# EAGLE design 1 byte output (EAGLE 9.5.0)
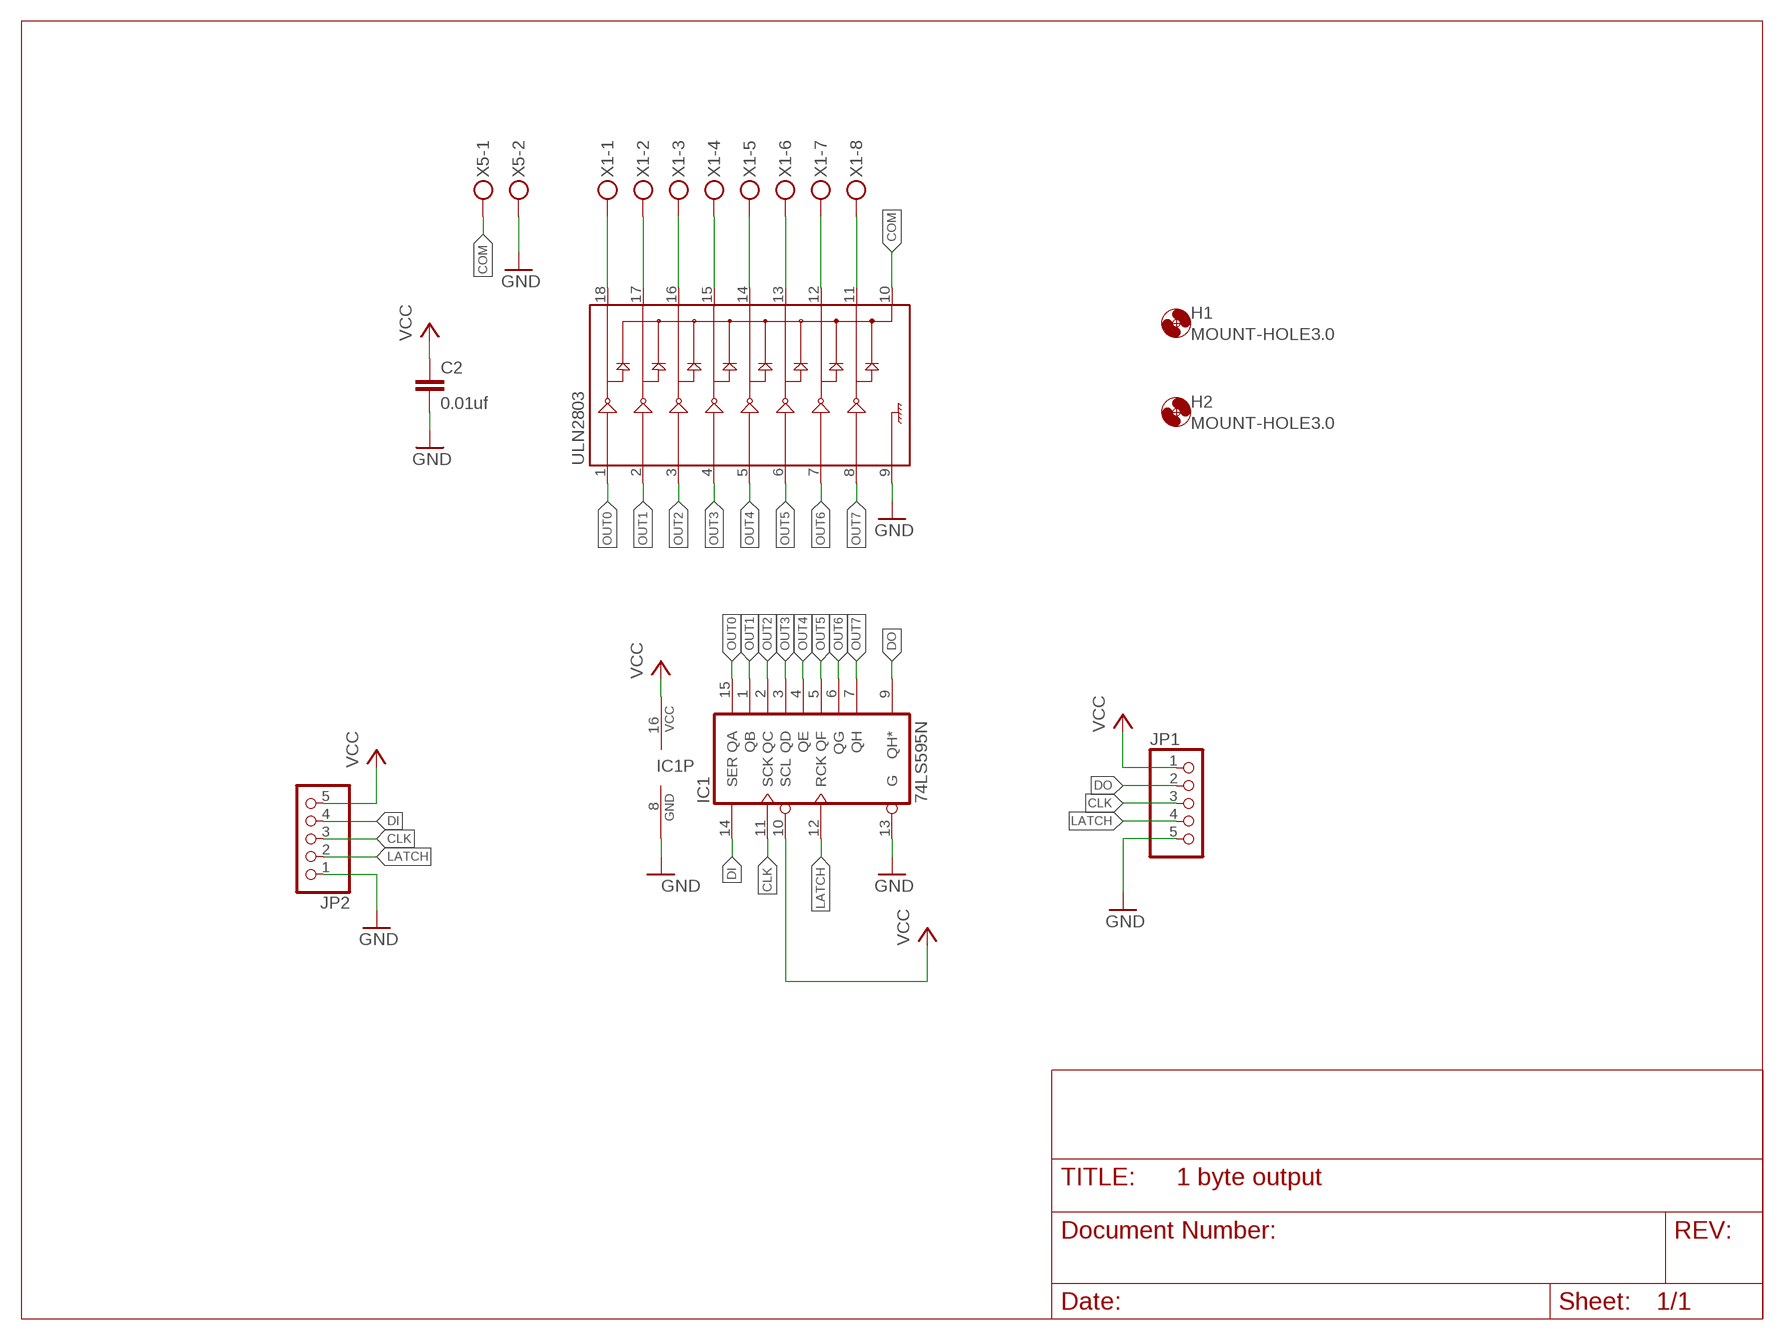
[diagram p0: schematic, sheet 1]

## Parts
C2  0.01uf  C-EU050-035X075  [C050-035X075]
H1  MOUNT-HOLE3.0  [3,0]
H2  MOUNT-HOLE3.0  [3,0]
IC1  74LS595N  [DIL16]
JP1  PINHD-1X5/90  [1X05/90]
JP2  PINHD-1X5/90  [1X05/90]
ULN2803  ULN2803DIP  [DIL18]
X1  MKDSN1,5/8-5,08  [MKDSN1,5/8-5,08]
X5  MKDSN1,5/2-5,08  [MKDSN1,5/2-5,08]

## Nets
CLK: IC1.11(SCK) JP1.3 JP2.3
COM: ULN2803.10 X5.1
DI: IC1.14(SER) JP2.4
DO: IC1.9(QH*) JP1.2
GND: C2.2 IC1.8(GND) IC1.13(G) JP1.5 JP2.1 ULN2803.9 X5.2
LATCH: IC1.12(RCK) JP1.4 JP2.2
N$1: ULN2803.18 X1.1
N$2: ULN2803.17 X1.2
N$3: ULN2803.16 X1.3
N$4: ULN2803.15 X1.4
N$5: ULN2803.14 X1.5
N$6: ULN2803.13 X1.6
N$7: ULN2803.12 X1.7
N$8: ULN2803.11 X1.8
OUT0: IC1.15(QA) ULN2803.1
OUT1: IC1.1(QB) ULN2803.2
OUT2: IC1.2(QC) ULN2803.3
OUT3: IC1.3(QD) ULN2803.4
OUT4: IC1.4(QE) ULN2803.5
OUT5: IC1.5(QF) ULN2803.6
OUT6: IC1.6(QG) ULN2803.7
OUT7: IC1.7(QH) ULN2803.8
VCC: C2.1 IC1.10(SCL) IC1.16(VCC) JP1.1 JP2.5

## Library data of the parts
C2 = resistor:C-EU: CAPACITOR, European symbol
H1 H2 = holes:MOUNT-HOLE: MOUNTING HOLE with drill center marker
IC1 = 74xx-us:74*595: 8-bit SHIFT REGISTER, output latch
JP1 JP2 = pinhead:PINHD-1X5: PIN HEADER
ULN2803 = SparkFun-IC-Special-Function:ULN2803: Darlington Driver(IC-07959, low stock) ULN2803 Darlington array. 500mA max per channel, 8-channel package. Spark Fun Electronics SKU : COM-00312
X1 = con-phoenix-508:MKDSN1,5/8-5,08: MKDSN 1,5/ 8-5,08 Printklemme Nennstrom: 13,5 A Nennspannung: 250 V Rastermaß: 5,08 mm Polzahl: 8 Anschlussart: Schraubanschluss Montage: Löten Anschlussrichtung Leiter/Platine: 0 ° Artikelnummer: 1729186 Source: http://eshop.phoenixcontact.com .. 1729186.pdf
X5 = con-phoenix-508:MKDSN1,5/2-5,08: MKDSN 1,5/ 2-5,08 Printklemme Nennstrom: 13,5 A Nennspannung: 250 V Rastermaß: 5,08 mm Polzahl: 2 Anschlussart: Schraubanschluss Montage: Löten Anschlussrichtung Leiter/Platine: 0 ° Artikelnummer: 1729128 Source: http://eshop.phoenixcontact.com .. 1729128.pdf

## Board
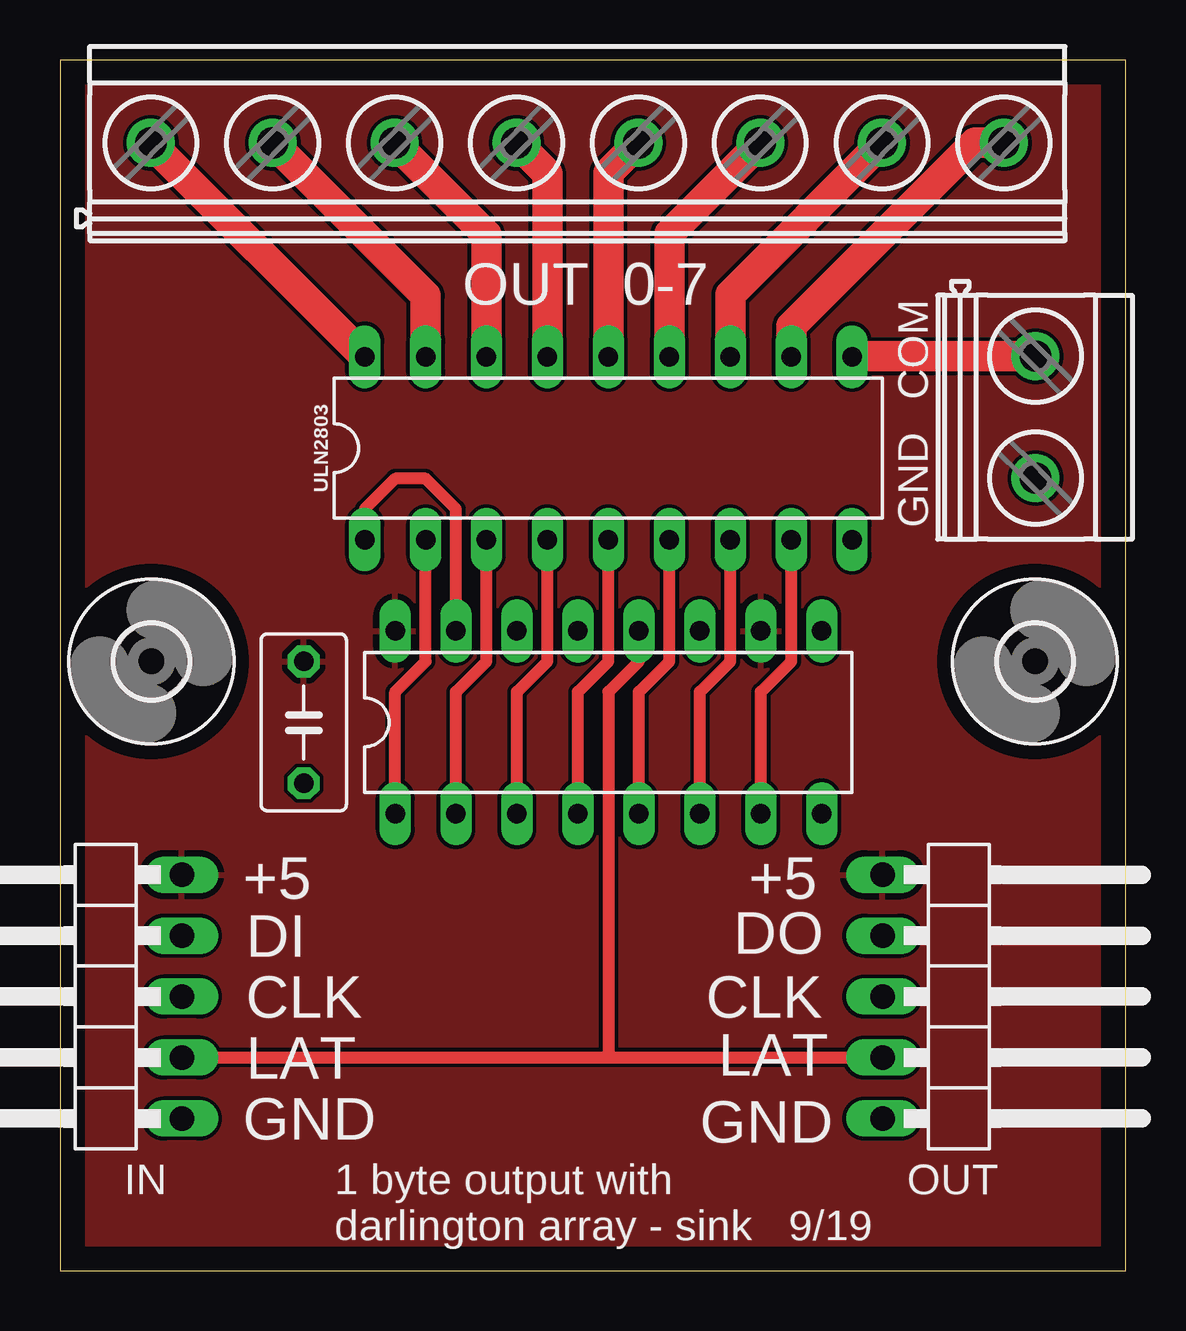
[diagram p1: board, top side]
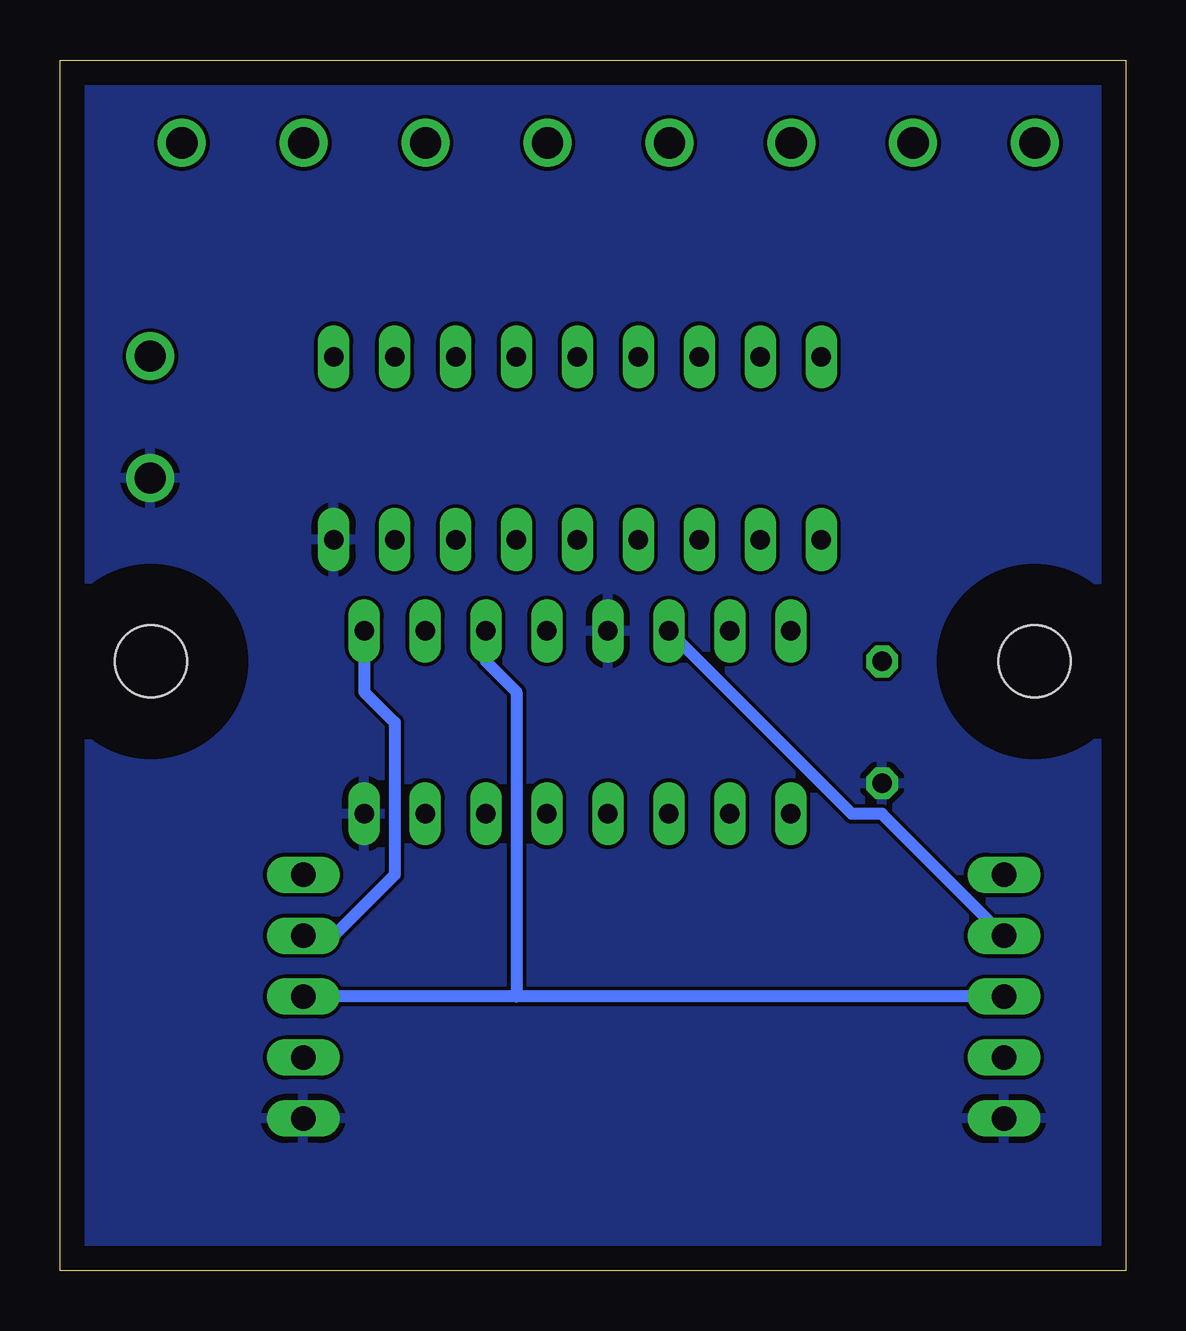
[diagram p2: board, bottom side, seen from below]

Size 44.43 x 50.47 mm. Coordinates in mm from the lower left corner, seen from the top.
Outline: 0,0 44.43,0 44.43,50.47 0,50.47 0,0
Copper layers (1*16): Top 0.035mm / dielectric 1.5mm / Bottom 0.035mm
Design rules "default": minimum track width 6mil, minimum drill 0.35mm, track to track 6mil, track to pad 6mil, pad to pad 6mil, via to via 6mil, smd to smd 6mil, copper to edge 40mil, drill to drill 6mil, minimum pad ring 10mil, minimum via ring 8mil, stop-mask expansion 4mil, vias tented up to drill 0mil, thermal gap 10mil

### Footprints (pad centres in the part's own frame; a part is rotated, then mirrored left to right if it is on the bottom)
C050-035X075 = drill 0.813 octagon: 1 -2.54,0; 2 2.54,0
3,0 = hole 3: 0,0
DIL16 = drill 0.813 long: 1 -8.89,-3.81; 2 -6.35,-3.81; 3 -3.81,-3.81; 4 -1.27,-3.81; 5 1.27,-3.81; 6 3.81,-3.81; 7 6.35,-3.81; 8 8.89,-3.81; 9 8.89,3.81; 10 6.35,3.81; 11 3.81,3.81; 12 1.27,3.81; 13 -1.27,3.81; 14 -3.81,3.81; 15 -6.35,3.81; 16 -8.89,3.81
1X05/90 = drill 1.016 long: 1 -5.08,-3.81; 2 -2.54,-3.81; 3 0,-3.81; 4 2.54,-3.81; 5 5.08,-3.81
DIL18 = drill 0.813 long: 1 -10.16,-3.81; 2 -7.62,-3.81; 3 -5.08,-3.81; 4 -2.54,-3.81; 5 0,-3.81; 6 2.54,-3.81; 7 5.08,-3.81; 8 7.62,-3.81; 9 10.16,-3.81; 10 10.16,3.81; 11 7.62,3.81; 12 5.08,3.81; 13 2.54,3.81; 14 0,3.81; 15 -2.54,3.81; 16 -5.08,3.81; 17 -7.62,3.81; 18 -10.16,3.81
MKDSN1,5/8-5,08 = drill 1.3 pad 2: 1 -17.801,0.025; 2 -12.721,0.025; 3 -7.641,0.025; 4 -2.561,0.025; 5 2.519,0.025; 6 7.599,0.025; 7 12.679,0.025; 8 17.759,0.025
MKDSN1,5/2-5,08 = drill 1.3 pad 2: 1 -2.561,0.025; 2 2.519,0.025

### Placement (x,y rotation side)
C2  10.16,22.86 270 top
H1  3.81,25.4 0 top
H2  40.64,25.4 0 top
IC1  22.86,22.86 0 top
JP1  38.1,11.43 270 top
JP2  1.27,11.43 90 top
ULN2803  22.86,34.29 0 top
X1  21.59,46.99 0 top
X5  40.64,35.56 270 top

### Tracks (layer width: path | path; a pad name or v marks a point on that pad's centre or on a via)
CLK
  Bottom 0.508: JP2.3 25.4,11.43 | 25.4,11.43 JP1.3 | IC1.11 26.67,25.4 25.4,24.13 25.4,11.43
COM
  Top 1.27: ULN2803.10 33.04,38.12 X5.1
DI
  Bottom 0.508: JP2.4 10.16,19.05 11.43,19.05 IC1.14
DO
  Bottom 0.508: IC1.9 31.75,24.13 30.48,22.86 30.48,16.51 33.02,13.97 JP1.2
GND
  pour Bottom: -3.81,54.61 85.09,54.61 85.09,-2.54 -3.81,-2.54
LATCH
  Top 0.508: JP2.2 22.86,8.89 | 22.86,8.89 JP1.4 | IC1.12 24.13,25.4 22.86,24.13 22.86,8.89
N$1
  Top 1.27: ULN2803.18 X1.1
N$2
  Top 1.27: ULN2803.17 15.24,40.64 X1.2
N$3
  Top 1.27: ULN2803.16 17.78,43.18 X1.3
N$4
  Top 1.27: ULN2803.15 20.32,45.72 X1.4
N$5
  Top 1.27: ULN2803.14 22.86,45.77 X1.5
N$6
  Top 1.27: ULN2803.13 25.4,43.23 X1.6
N$7
  Top 1.27: ULN2803.12 27.94,40.69 X1.7
N$8
  Top 1.27: ULN2803.11 30.48,39.37 38.12,47.02 X1.8
OUT0
  Top 0.508: IC1.15 16.51,31.75 15.24,33.02 13.97,33.02 12.7,31.75 ULN2803.1
OUT1
  Top 0.508: IC1.1 13.97,24.13 15.24,25.4 ULN2803.2
OUT2
  Top 0.508: IC1.2 16.51,24.13 17.78,25.4 ULN2803.3
OUT3
  Top 0.508: IC1.3 19.05,24.13 20.32,25.4 ULN2803.4
OUT4
  Top 0.508: IC1.4 21.59,24.13 22.86,25.4 ULN2803.5
OUT5
  Top 0.508: IC1.5 24.13,24.13 25.4,25.4 ULN2803.6
OUT6
  Top 0.508: IC1.6 26.67,24.13 27.94,25.4 ULN2803.7
OUT7
  Top 0.508: IC1.7 29.21,24.13 30.48,25.4 ULN2803.8
VCC
  pour Top: -2.54,-3.81 -2.54,58.42 87.63,58.42 87.63,-3.81

### Text on the board
tNames: OUT 0-7 | COM | GND | +5 | +5 | DI | DO | CLK | CLK | LAT | LAT | GND | GND | IN | OUT | 1 byte output with / darlington array - sink 9/19